# Altium schematic sheet Sh_Input.SchDoc
size 199 x 199 mm
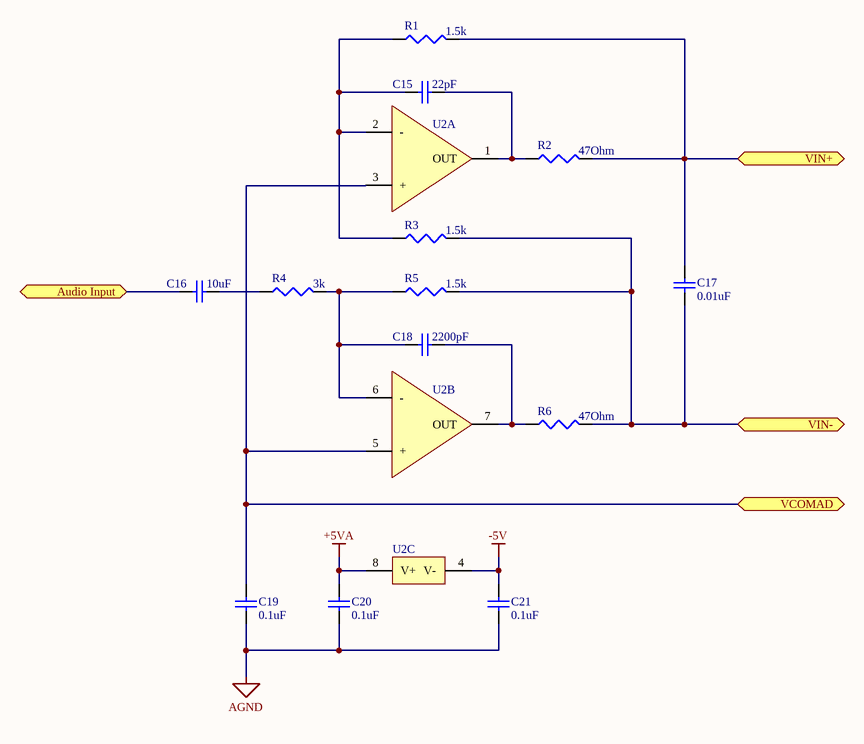
[diagram p0: Sh_Input.SchDoc]

## Parts
C15  value 22pF  [1608[0603]]  (hidden comment: Cap Semi)
C16  value 10uF  [1608[0603]]  (hidden comment: Cap Semi)
C17  value 0.01uF  [1608[0603]]  (hidden comment: Cap Semi)
C18  value 2200pF  [1608[0603]]  (hidden comment: Cap Semi)
C19  value 0.1uF  [1608[0603]]  (hidden comment: Cap Semi)
C20  value 0.1uF  [1608[0603]]  (hidden comment: Cap Semi)
C21  value 0.1uF  [1608[0603]]  (hidden comment: Cap Semi)
R1  value 1.5k  [J1-0603]  (hidden comment: Res3)
R2  value 47Ohm  [J1-0603]  (hidden comment: Res3)
R3  value 1.5k  [J1-0603]  (hidden comment: Res3)
R4  value 3k  [J1-0603]  (hidden comment: Res3)
R5  value 1.5k  [J1-0603]  (hidden comment: Res3)
R6  value 47Ohm  [J1-0603]  (hidden comment: Res3)
U2  NE5532A  [SOIC127P600-8AL]  (value not drawn)  (parts A,B,C of 3)

## Ports
Audio Input, VCOMAD, VIN+, VIN-

## Nets
+5VA: C20.1 U2.8(V+)
-5V: C21.1 U2.4(V-)
AGND: C19.2 C20.2 C21.2
Audio Input: C16.2 ; port Audio Input
VCOMAD: C19.1 U2.3(+) U2.5(+) ; port VCOMAD
VIN+: C17.1 R1.2 R2.2 ; port VIN+
VIN-: C17.2 R3.2 R5.2 R6.2 ; port VIN-
NetC15_1: C15.1 R2.1 U2.1(OUT)
NetC15_2: C15.2 R1.1 R3.1 U2.2(-)
NetC16_1: C16.1 R4.1
NetC18_1: C18.1 R6.1 U2.7(OUT)
NetC18_2: C18.2 R4.2 R5.1 U2.6(-)

## Library data of the parts
C15-C21 = Cap Semi: Capacitor (Semiconductor SIM Model); Published: 8-Jun-2000; LatestRevisionDate: 29-May-2009; LatestRevisionNote: IPC-7351 Footprint Added.; PackageReference: C1206; Publisher: Altium Limited; PackageDescription: Chip Capacitor
R1-R6 = Res3: Resistor; Published: 8-Jun-2000; LatestRevisionDate: 29-May-2009; LatestRevisionNote: IPC-7351 Footprint Added.; PackageReference: J1-0603; Publisher: Altium Limited; PackageDescription: Chip Resistor
U2 = Ampli_op: Amplificateur Opérationnel